# Altium schematic sheet Power.SchDoc
size A; SheetNumber: 3; SheetTotal: 7
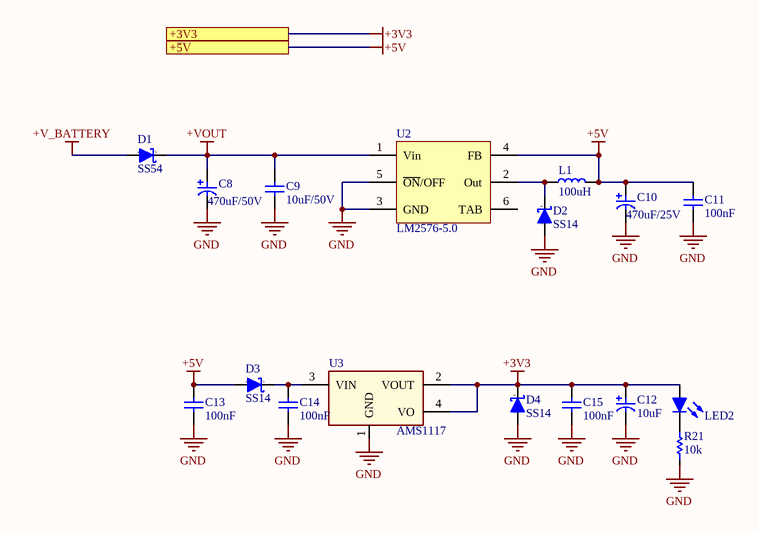
[diagram p0: Power.SchDoc]

## Parts
C8  470uF/50V  [C SMD ALU (G)]
C9  10uF/50V  [C 0603 (1608)]
C10  470uF/25V  [C SMD ALU (G)]
C11  100nF  [C 0603 (1608)]
C12  10uF  [C SMD ALU (B)]
C13  100nF  [C 0603 (1608)]
C14  100nF  [C 0603 (1608)]
C15  100nF  [C 0603 (1608)]
D1  SS54  [DO-214AC (SMA)]
D2  SS14  [DO-214AC (SMA)]
D3  SS14  [DO-214AC (SMA)]
D4  SS14  [DO-214AC (SMA)]
L1  100uH  [Inductor SMD 0805 (2012)]
LED2  Led  [Led SMD 0603]  (value not drawn)
R21  10k  [R 0603 (1608)]
U2  LM2576-5.0  [TO-263-5]
U3  AMS1117  [SOT-223]

## Ports
+3V3, +5V

## Nets
+3V3: C12.1 C15.1 D4.1(A) LED2.2(A) U3.2(VOUT) U3.4(VO) ; port +3V3
+5V: C10.1 C11.1 C13.1 D3.2(K) L1.2 U2.4(FB) ; port +5V
+V_BATTERY: D1.2(K)
+VOUT: C8.1 C9.1 D1.1(A) U2.1(Vin)
GND: C8.2 C9.2 C10.2 C11.2 C12.2 C13.2 C14.2 C15.2 D2.2(K) D4.2(K) R21.1 U2.3(GND) U2.5(~{ON}/OFF) U3.1(GND)
NetC14_1: C14.1 D3.1(A) U3.3(VIN)
NetD2_1: D2.1(A) L1.1 U2.2(Out)
NetLED2_1: LED2.1(K) R21.2

Not connected (* = marked no-connect by the designer): U2 6(TAB)

## Notes on the sheet
- (in symbol Diode Schottky) a; k

## Library data of the parts
C8 C10 C12 = Capacitor: Capacitor pol
C9 C11 C13-C15 = Capacitor NP: Capacitor non-pol
D1-D4 = Diode Schottky: Schottky Diode; Published: 8-Jun-2000; LatestRevisionDate: 17-Jul-2002; LatestRevisionNote: Re-released for DXP Platform.; PackageReference: SMB; Publisher: Altium Limited; Code_JEDEC: DO-214-AA
L1 = Inductor
LED2 = Led: Typical LED
R21 = Resistor: Published: 8-Jun-2000; LatestRevisionDate: 17-Jul-2002; LatestRevisionNote: Re-released for DXP Platform.; PackageReference: AXIAL-0.3; Publisher: Altium Limited
U2 = LM2576/96: SIMPLE SWITCHER® 3A Step-Down Voltage Regulator
U3 = AMS1117: 1A LDO Voltage Regulator, ADJ or fixed 1.5/1.8/2.5/2.85/3.3/5V